# Altium schematic sheet Practica 5 - Display7seg.SchDoc
size Legal; Engineer: Roberto Isaac Suaste Martinez; Organization: Mecatronica Digital; Address1: www.mecatronicadigital.com; Address2: info@mecatronicadigital.com; Address3: Dpto. Diseño Electronico
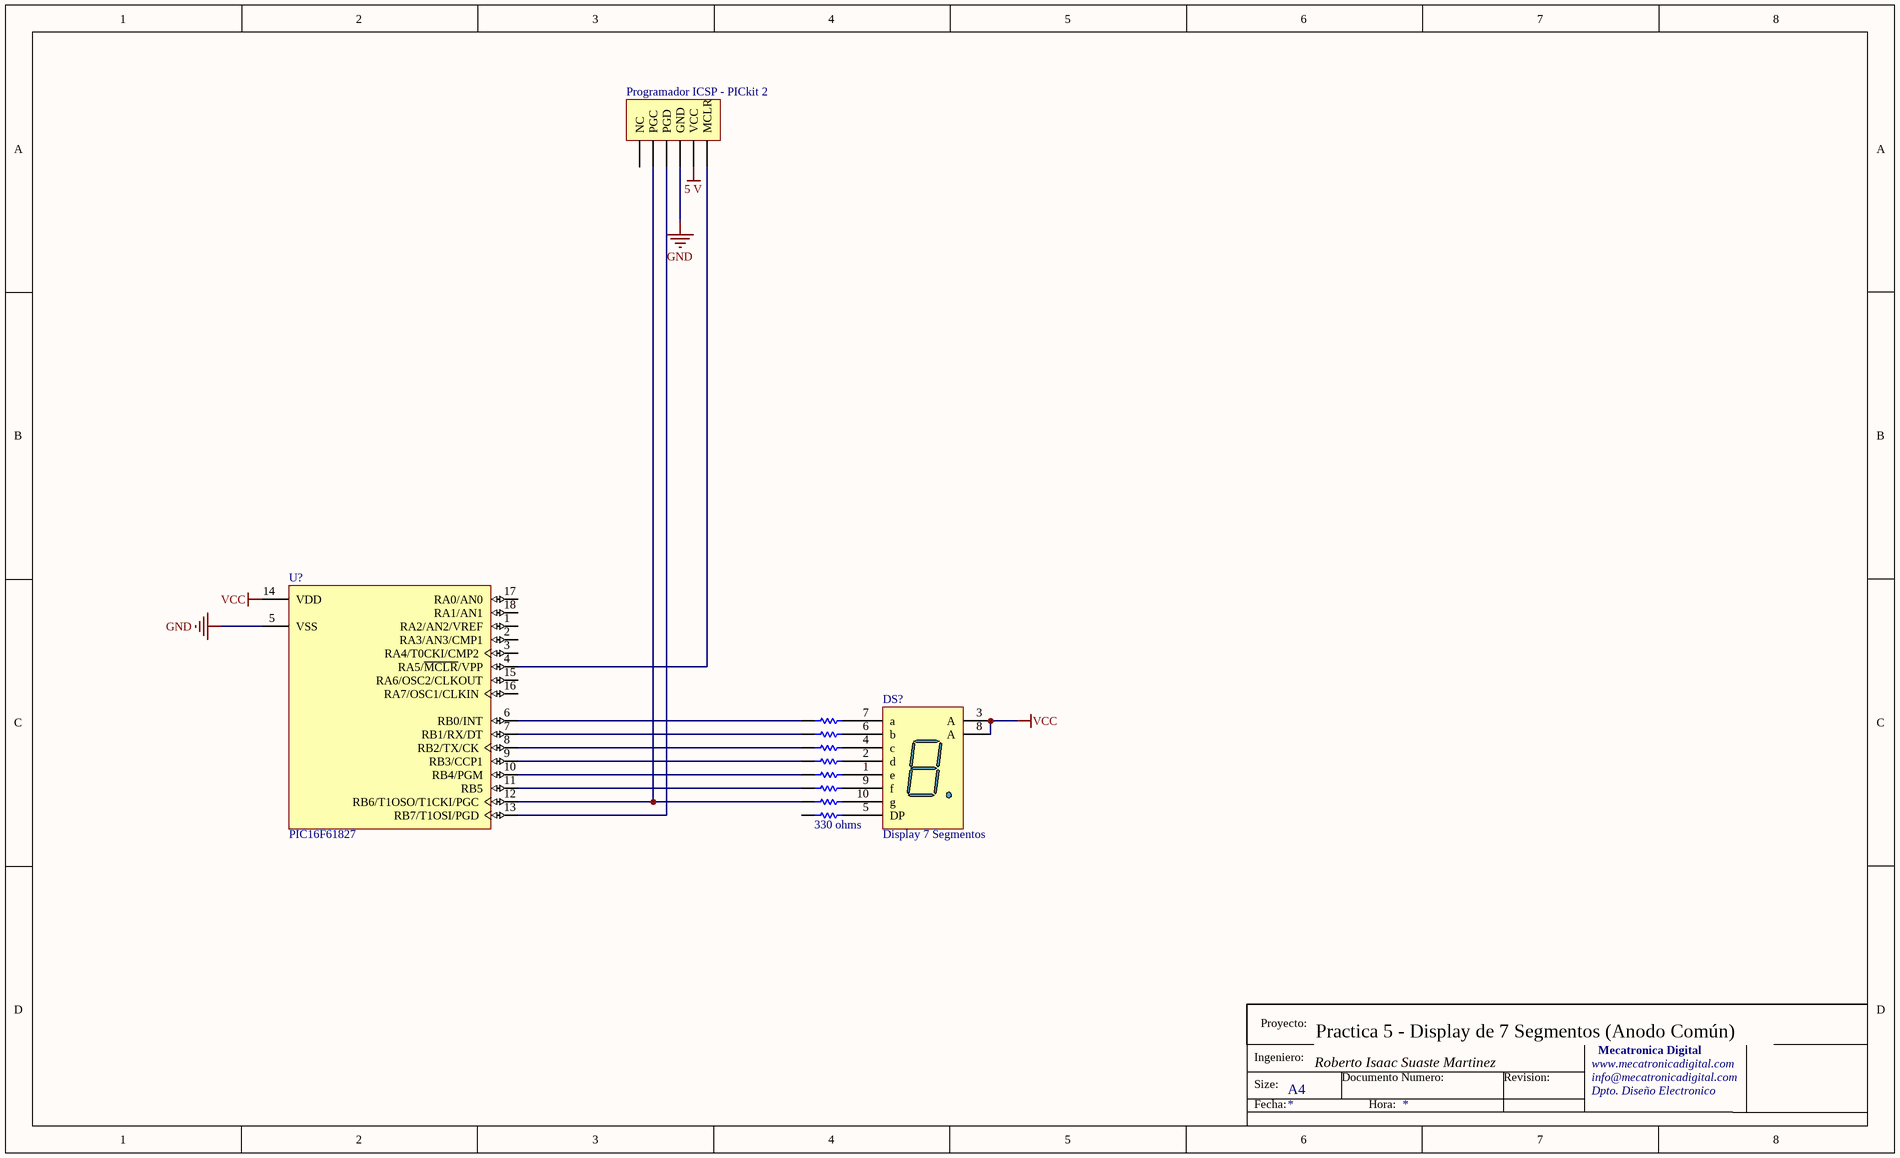
[diagram p0: Practica 5 - Display7seg.SchDoc]

## Parts
(Parts that share a designator on the sheet are numbered #1, #2 ... from top to bottom, then left to right.)
330_ohms  Resistencia 1/4 de watt  [330 Ohm]  (value not drawn)
?  Resistencia 1/4 de watt  [330 Ohm]  (value not drawn)
DS?  Display 7 Segmentos  [DISPLAY1]
Programador_ICSP_-_PICkit_2  Header 6  [Header 1X6]  (value not drawn)
R?#1  Resistencia 1/4 de watt  [330 Ohm]  (value not drawn)
R?#2  Resistencia 1/4 de watt  [330 Ohm]  (value not drawn)
R?#3  Resistencia 1/4 de watt  [330 Ohm]  (value not drawn)
R?#4  Resistencia 1/4 de watt  [330 Ohm]  (value not drawn)
R?#5  Resistencia 1/4 de watt  [330 Ohm]  (value not drawn)
R?#6  Resistencia 1/4 de watt  [330 Ohm]  (value not drawn)
U?  PIC16F61827  [PDIP300-P18]

## Nets
5 V: Programador_ICSP_-_PICkit_2.2(VCC)
GND: Programador_ICSP_-_PICkit_2.3(GND) U?.5(VSS)
VCC: DS?.3(A) DS?.8(A) U?.14(VDD)
Net330_ohms_2: 330_ohms.2 DS?.5(DP)
Net?_1: ?.1 U?.8(RB2/TX/CK)
Net?_2: ?.2 DS?.4(c)
NetDS?_1: DS?.1(e) R?#4.2
NetDS?_2: DS?.2(d) R?#3.2
NetDS?_6: DS?.6(b) R?#2.2
NetDS?_7: DS?.7(a) R?#1.2
NetDS?_9: DS?.9(f) R?#5.2
NetDS?_10: DS?.10(g) R?#6.2
NetProgramador_ICSP_-_PICkit_2_1: Programador_ICSP_-_PICkit_2.1(MCLR) U?.4(RA5/~{MCLR}/VPP)
NetProgramador_ICSP_-_PICkit_2_4: Programador_ICSP_-_PICkit_2.4(PGD) U?.13(RB7/T1OSI/PGD)
NetProgramador_ICSP_-_PICkit_2_5: Programador_ICSP_-_PICkit_2.5(PGC) R?#6.1 U?.12(RB6/T1OSO/T1CKI/PGC)
NetR?#1_1: R?#1.1 U?.6(RB0/INT)
NetR?#2_1: R?#2.1 U?.7(RB1/RX/DT)
NetR?#3_1: R?#3.1 U?.9(RB3/CCP1)
NetR?#4_1: R?#4.1 U?.10(RB4/PGM)
NetR?#5_1: R?#5.1 U?.11(RB5)

Not connected (* = marked no-connect by the designer): 330_ohms 1; Programador_ICSP_-_PICkit_2 6(NC); U? 1(RA2/AN2/VREF) 2(RA3/AN3/CMP1) 3(RA4/T0CKI/CMP2) 15(RA6/OSC2/CLKOUT) 16(RA7/OSC1/CLKIN) 17(RA0/AN0) 18(RA1/AN1)

## Notes on the sheet
- 5 - Display de 7 Segmentos (Anodo Común)
- Proyecto:
- Practica
- Ingeniero:
- Size:
- Fecha:
- A4
- Documento Numero:
- Hora:
- Revision:

## Library data of the parts
330_ohms ? R?#1-R?#6 = Resistor 1/4 watt: Resistor empaque ceramico axial de 1/4 de watt; Published: 8-Jun-2000; LatestRevisionDate: 17-Jul-2002; LatestRevisionNote: Re-released for DXP Platform.; PackageReference: AXIAL-0.5; Publisher: Altium Limited
DS? = Dpy Blue-CA: 14.2 mm General Purpose Blue 7-Segment Display: CA, RH DP, Gray Surface; MinimumIntensity: 2020 ucd; Note: IF = 10 mA; Published: 8-Jun-2000; LatestRevisionDate: 17-Dec-2003; LatestRevisionNote: Schematic revised, PCB Footprint replaced.; DatasheetDocument: 24-Sep-2002; PackageDocument: 24-Sep-2002; PackageReference: H; Publisher: Altium Limited; Colour: Blue; ComponentLink1Description: Manufacturer Link; ComponentLink1URL: http://www.agilent.com/
Programador_ICSP_-_PICkit_2 = Header 6: Header, 6-Pin; LatestRevisionDate: 17-Jul-2002; LatestRevisionNote: Re-released for DXP Platform.; Publisher: Altium Limited
U? = PIC16F628A-I/P: FLASH-Based 8-Bit CMOS Microcontroller with nanoWatt Technology, 2K (x14-Bit words) FLASH, 224 Bytes SRAM, 18-Pin PDIP, 3.0 to 5.5V Supply Range, Industrial Temperature; Published: 11-Oct-2004; LatestRevisionDate: 29-Jan-2009; LatestRevisionNote: Sch. layout revised. 3D Model Removed.; DatasheetVersion: revF, Mar-2007; PackageVersion: revBB, Aug-2009; PackageReference: PDIP300-P18; Publisher: Altium Limited; PackageDescription: 18-Lead Plastic Dual In-Line (P) - 300 mil Body [PDIP]; Supplier 1: Digi-Key; Supplier Part Number 1: PIC16F628A-I/P-ND; Supplier 2: Farnell; Supplier Part Number 2: 9771549; Supplier 3: Farnell; Supplier Part Number 3: 1523938; Supplier 4: Farnell; Supplier Part Number 4: 9760423; Code_JEDEC: MS-001; ComponentLink1Description: Datasheet; ComponentLink1URL: http://ww1.microchip.com/downloads/en/DeviceDoc/40044F.pdf; ComponentLink2Description: Packaging Specification; ComponentLink2URL: http://www.microchip.com/stellent/groups/techpub_sg/documents/packagingspec/en012702.pdf; ComponentLink3Description: Microchip.com Home; ComponentLink3URL: http://www.microchip.com/